# Altium project CMTestBoard.PrjPcb (part 2 of 2)

## Sheet 2_STM32F4.SchDoc
size Letter
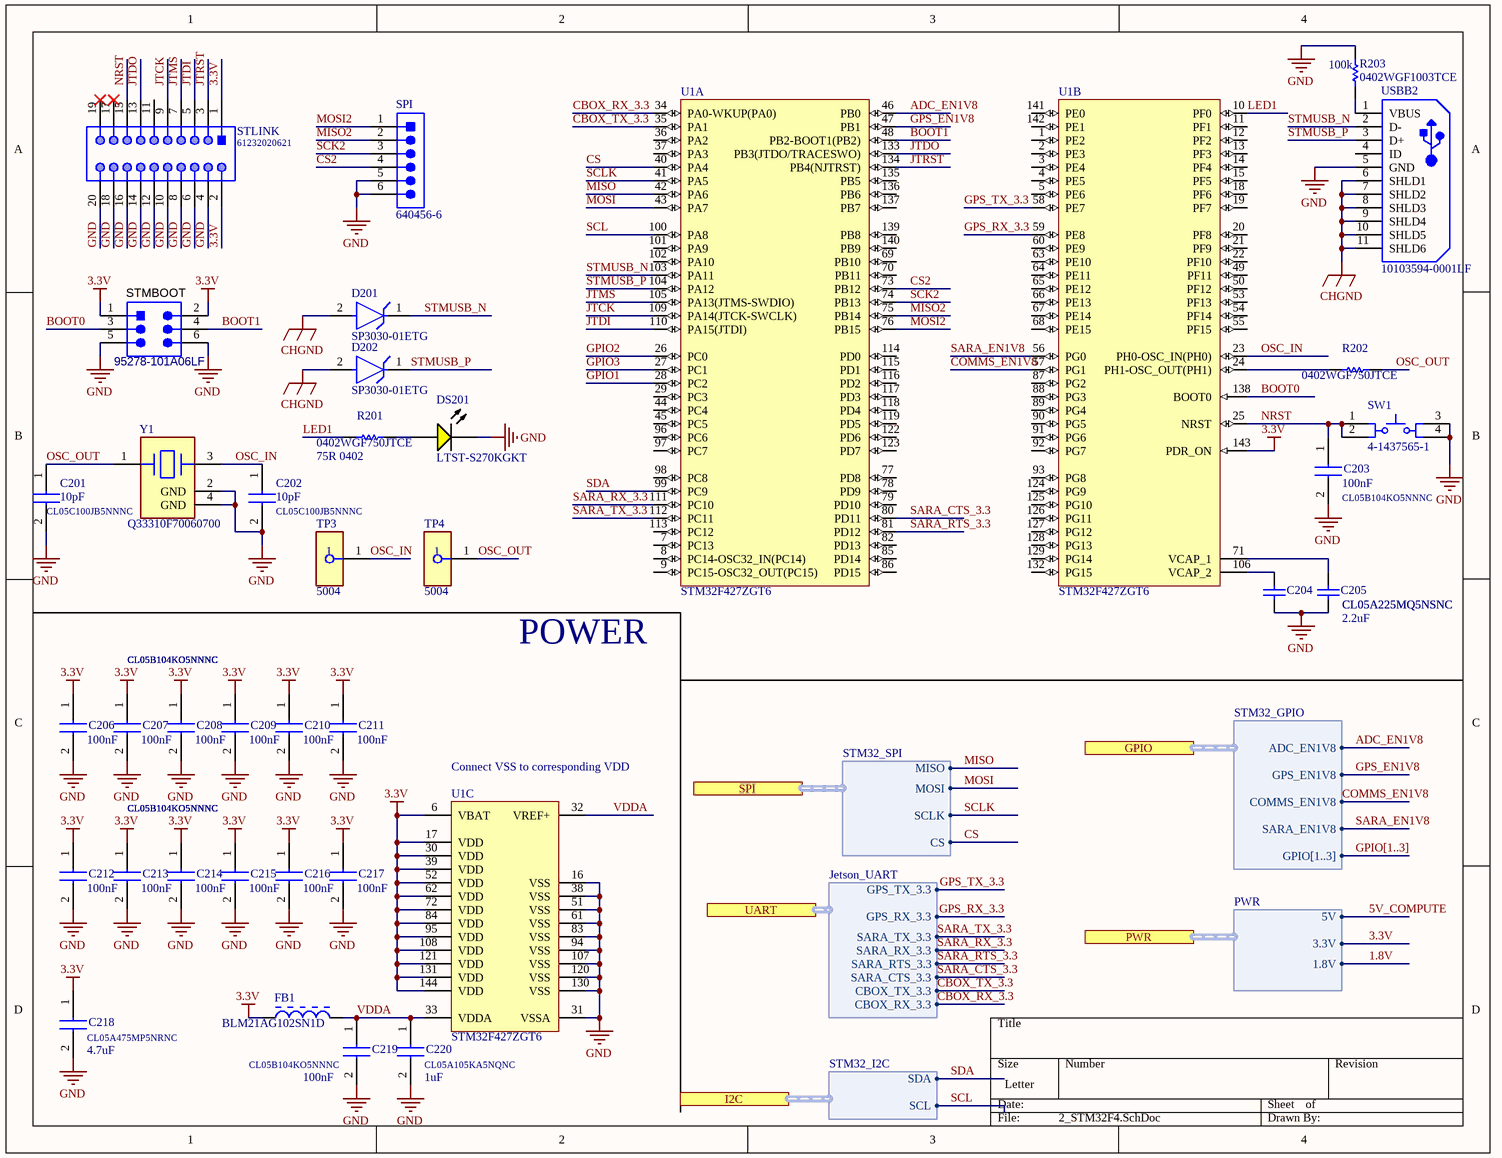
[diagram p5: 2_STM32F4.SchDoc]

### Parts
(Parts that share a designator on the sheet are numbered #1, #2 ... from top to bottom, then left to right.)
C201  CL05C100JB5NNNC  value 10pF  [CAPC1005X55N]
C202  CL05C100JB5NNNC  value 10pF  [CAPC1005X55N]
C203  CL05B104KO5NNNC  value 100nF  [CAPC1005X55N]
C204  CL05A225MQ5NSNC  [0402]
C205  CL05A225MQ5NSNC  [0402]
C206  CL05B104KO5NNNC  value 100nF  [CAPC1005X55N]
C207  CL05B104KO5NNNC  value 100nF  [CAPC1005X55N]
C208  CL05B104KO5NNNC  value 100nF  [CAPC1005X55N]
C209  CL05B104KO5NNNC  value 100nF  [CAPC1005X55N]
C210  CL05B104KO5NNNC  value 100nF  [CAPC1005X55N]
C211  CL05B104KO5NNNC  value 100nF  [CAPC1005X55N]
C212  CL05B104KO5NNNC  value 100nF  [CAPC1005X55N]
C213  CL05B104KO5NNNC  value 100nF  [CAPC1005X55N]
C214  CL05B104KO5NNNC  value 100nF  [CAPC1005X55N]
C215  CL05B104KO5NNNC  value 100nF  [CAPC1005X55N]
C216  CL05B104KO5NNNC  value 100nF  [CAPC1005X55N]
C217  CL05B104KO5NNNC  value 100nF  [CAPC1005X55N]
C218  CL05A475MP5NRNC  value 4.7uF  [CAPC1005X55N]
C219  CL05B104KO5NNNC  value 100nF  [CAPC1005X55N]
C220  CL05A105KA5NQNC  value 1uF  [CAPC1005X55N]
D201  SP3030-01ETG  [FP-SP3030-MFG]
D202  SP3030-01ETG  [FP-SP3030-MFG]
DS201  LTST-S270KGKT  [AVAG-HSMX-C190_V]
FB1  BLM21AG102SN1D  [MURA-BLM21-H1-CHIP-2_V]
R201  0402WGF750JTCE  [RESC1005X40X25ML05T10]
R202  0402WGF750JTCE  [RESC1005X40X25ML05T10]
R203  0402WGF1003TCE  [0402]
SPI  640456-6  [TECO-640456-6_V]
STLINK  61232020621  [61232020621]
STMBOOT  95278-101A06LF  [AMPM-95278-101A06LF_V]
SW1#1  4-1437565-1  [TECO-4-1437565-1_V]
TP3  5004  [FP-5004-MFG]
TP4  5004  [FP-5004-MFG]
U1#1  STM32F427ZGT6  [STM-LQFP144_V]  (parts A,B,C of 3)
USBB2  10103594-0001LF  [FCI-10103594-0001LF_V]
Y1  Q33310F70060700  [FP-7M-MFG]

### Ports
GPIO (harness STM32_GPIO), I2C (harness STM32_I2C), PWR (harness PWR), SPI (harness STM32_SPI), UART (harness Jetson_UART)

### Harnesses
STM32_I2C: SDA, SCL
STM32_SPI: MISO, MOSI, SCLK, CS
STM32_GPIO: ADC_EN1V8, GPS_EN1V8, COMMS_EN1V8, SARA_EN1V8, GPIO[1..3]
PWR: 5V, 3.3V, 1.8V
Jetson_UART: GPS_TX_3.3, GPS_RX_3.3, SARA_TX_3.3, SARA_RX_3.3, CBOX_TX_3.3, CBOX_RX_3.3, SARA_RTS_3.3, SARA_CTS_3.3

### Nets
3.3V: C206.1 C207.1 C208.1 C209.1 C210.1 C211.1 C212.1 C213.1 C214.1 C215.1 C216.1 C217.1 C218.1 FB1.1 STLINK.1 STLINK.2 STMBOOT.1 STMBOOT.2 U1#1.6(VBAT) U1#1.17(VDD) U1#1.30(VDD) U1#1.39(VDD) U1#1.52(VDD) U1#1.62(VDD) U1#1.72(VDD) U1#1.84(VDD) U1#1.95(VDD) U1#1.108(VDD) U1#1.121(VDD) U1#1.131(VDD) U1#1.143(PDR_ON) U1#1.144(VDD) ; port PWR.3.3V
CHGND: D201.2(A) D202.2(A) USBB2.6(SHLD1) USBB2.7(SHLD2) USBB2.8(SHLD3) USBB2.9(SHLD4) USBB2.10(SHLD5) USBB2.11(SHLD6)
GND: C201.2 C202.2 C203.2 C204.1 C205.1 C206.2 C207.2 C208.2 C209.2 C210.2 C211.2 C212.2 C213.2 C214.2 C215.2 C216.2 C217.2 C218.2 C219.2 C220.2 DS201.2(K) R203.2 SPI.5 SPI.6 STLINK.4 STLINK.6 STLINK.8 STLINK.10 STLINK.12 STLINK.14 STLINK.16 STLINK.18 STLINK.20 STMBOOT.5 STMBOOT.6 SW1#1.3 SW1#1.4 U1#1.16(VSS) U1#1.31(VSSA) U1#1.38(VSS) U1#1.51(VSS) U1#1.61(VSS) U1#1.83(VSS) U1#1.94(VSS) U1#1.107(VSS) U1#1.120(VSS) U1#1.130(VSS) USBB2.5(GND) Y1.2(GND) Y1.4(GND)
ADC_EN1V8: U1#1.46(PB0) ; port GPIO.ADC_EN1V8
BOOT0: STMBOOT.3 U1#1.138(BOOT0)
BOOT1: STMBOOT.4 U1#1.48(PB2-BOOT1(PB2))
CBOX_RX_3.3: U1#1.34(PA0-WKUP(PA0)) ; port UART.CBOX_RX_3.3
CBOX_TX_3.3: U1#1.35(PA1) ; port UART.CBOX_TX_3.3
COMMS_EN1V8: U1#1.57(PG1) ; port GPIO.COMMS_EN1V8
CS: U1#1.40(PA4) ; port SPI.CS
CS2: SPI.4 U1#1.73(PB12)
GPIO1: U1#1.28(PC2)
GPIO2: U1#1.26(PC0)
GPIO3: U1#1.27(PC1)
GPS_EN1V8: U1#1.47(PB1) ; port GPIO.GPS_EN1V8
GPS_RX_3.3: U1#1.59(PE8) ; port UART.GPS_RX_3.3
GPS_TX_3.3: U1#1.58(PE7) ; port UART.GPS_TX_3.3
JTCK: STLINK.9 U1#1.109(PA14(JTCK-SWCLK))
JTDI: STLINK.5 U1#1.110(PA15(JTDI))
JTDO: STLINK.13 U1#1.133(PB3(JTDO/TRACESWO))
JTMS: STLINK.7 U1#1.105(PA13(JTMS-SWDIO))
JTRST: STLINK.3 U1#1.134(PB4(NJTRST))
LED1: R201.2 U1#1.10(PF0)
MISO: U1#1.42(PA6) ; port SPI.MISO
MISO2: SPI.2 U1#1.75(PB14)
MOSI: U1#1.43(PA7) ; port SPI.MOSI
MOSI2: SPI.1 U1#1.76(PB15)
NRST: C203.1 STLINK.15 SW1#1.1 SW1#1.2 U1#1.25(NRST)
OSC_IN: C202.1 TP3.1 U1#1.23(PH0-OSC_IN(PH0)) Y1.3
OSC_OUT: C201.1 R202.1 TP4.1 Y1.1
SARA_CTS_3.3: U1#1.80(PD11) ; port UART.SARA_CTS_3.3
SARA_EN1V8: U1#1.56(PG0) ; port GPIO.SARA_EN1V8
SARA_RTS_3.3: U1#1.81(PD12) ; port UART.SARA_RTS_3.3
SARA_RX_3.3: U1#1.111(PC10) ; port UART.SARA_RX_3.3
SARA_TX_3.3: U1#1.112(PC11) ; port UART.SARA_TX_3.3
SCK2: SPI.3 U1#1.74(PB13)
SCL: U1#1.100(PA8) ; port I2C.SCL
SCLK: U1#1.41(PA5) ; port SPI.SCLK
SDA: U1#1.99(PC9) ; port I2C.SDA
STMUSB_N: D201.1(C) U1#1.103(PA11) USBB2.2(D-)
STMUSB_P: D202.1(C) U1#1.104(PA12) USBB2.3(D+)
VDDA: C219.1 C220.1 FB1.2 U1#1.32(VREF+) U1#1.33(VDDA)
NetC204_2: C204.2 U1#1.106(VCAP_2)
NetC205_2: C205.2 U1#1.71(VCAP_1)
NetDS201_1: DS201.1(A) R201.1
NetR202_2: R202.2 U1#1.24(PH1-OSC_OUT(PH1))
NetR203_1: R203.1 USBB2.1(VBUS)

Not connected (* = marked no-connect by the designer): STLINK 11 17* 19*; U1#1 1(PE2) 2(PE3) 3(PE4) 4(PE5) 5(PE6) 7(PC13) 8(PC14-OSC32_IN(PC14)) 9(PC15-OSC32_OUT(PC15)) 11(PF1) 12(PF2) 13(PF3) 14(PF4) 15(PF5) 18(PF6) 19(PF7) 20(PF8) 21(PF9) 22(PF10) 29(PC3) 36(PA2) 37(PA3) 44(PC4) 45(PC5) 49(PF11) 50(PF12) 53(PF13) 54(PF14) 55(PF15) 60(PE9) 63(PE10) 64(PE11) 65(PE12) 66(PE13) 67(PE14) 68(PE15) 69(PB10) 70(PB11) 77(PD8) 78(PD9) 79(PD10) 82(PD13) 85(PD14) 86(PD15) 87(PG2) 88(PG3) 89(PG4) 90(PG5) 91(PG6) 92(PG7) 93(PG8) 96(PC6) 97(PC7) 98(PC8) 101(PA9) 102(PA10) 113(PC12) 114(PD0) 115(PD1) 116(PD2) 117(PD3) 118(PD4) 119(PD5) 122(PD6) 123(PD7) 124(PG9) 125(PG10) 126(PG11) 127(PG12) 128(PG13) 129(PG14) 132(PG15) 135(PB5) 136(PB6) 137(PB7) 139(PB8) 140(PB9) 141(PE0) 142(PE1); USBB2 4(ID)

### Buses and harness runs
bus GPIO[1..3]

### Notes on the sheet
- (near R203) 100k
- (near R201) 75R 0402
- (near C205) 2.2uF
- POWER
- (near U1#1) Connect VSS to corresponding VDD

### Library data of the parts
C201 C202 = C0402C560K5RACTU: 10pF 0402; Manufacturer_Name: Kemet; Datasheet Link: https://content.kemet.com/datasheets/KEM_C1002_X7R_SMD.pdf; Height: 0.55mm; Manufacturer_Part_Number: C0402C560K5RACTU; Arrow Part Number: C0402C560K5RACTU; Mouser Part Number: 80-C0402C560K5RACTU; Mouser Price/Stock: https://www.mouser.co.uk/ProductDetail/KEMET/C0402C560K5RACTU?qs=gt1LBUVyoHmQZW5v3ySgNQ%3D%3D
C203 C206-C220 = C0402C560K5RACTU: 100nF 0402; Manufacturer_Name: Kemet; Datasheet Link: https://content.kemet.com/datasheets/KEM_C1002_X7R_SMD.pdf; Height: 0.55mm; Manufacturer_Part_Number: C0402C560K5RACTU; Arrow Part Number: C0402C560K5RACTU; Mouser Part Number: 80-C0402C560K5RACTU; Mouser Price/Stock: https://www.mouser.co.uk/ProductDetail/KEMET/C0402C560K5RACTU?qs=gt1LBUVyoHmQZW5v3ySgNQ%3D%3D
C204 C205 = Cap: 2.2uF 0402; Published: 8-Jun-2000; LatestRevisionDate: 17-Jul-2002; LatestRevisionNote: Re-released for DXP Platform.; PackageReference: RAD-0.3; Publisher: Altium Limited; PackageDescription: Radial Cap, Thru-Hole; 2 Leads; 0.3 in Pin Spacing
D201 D202 = CMP-08607-000070-1: TVS DIODE 5V 10V SOD882; Manufacturer: Littelfuse; Max Junction Temp: +150°C; Automotive Grade: Grade 1; Direction: Unidirectional; Peak Pulse Current: 3A; Capacitance: 0.5pF; Value: 0.5pF; Number Of Channels: 1; Manufacturer Part Number: SP3030-01ETG; Temperature Range Low: -40°C; Lead Free: Yes; Package: SP3030; Device Class L2: TVS Diodes; Height: 0.6mm; ComponentLink2URL: https://www.littelfuse.com/~/media/electronics/datasheets/tvs_diode_arrays/littelfuse_tvs_diode_array_sp3030_datasheet.pdf.pdf; Device Class L3: unset; Category: Diode; Reverse Standoff Voltage: 5V; RoHS: TRUE; Digikey Description: TVS DIODE 5V 10V SOD882; Octopart: https://octopart.com/sp3030-01etg-littelfuse-29687287; ComponentLink2Description: Datasheet; Device Class L1: Circuit Protection; Automotive: Yes; Temperature: -40°C to +125°C; Temperature Range High: +125°C; Clamping Voltage: 10V; Mouser Description: TVS Diodes / ESD Suppressors 5V 1uA 22kV UNIDIRECTIONAL
DS201 = CMP-1744-00003-1: LED Uni-Color Yellow, 65 mW, 20 mA, -40 to 85 degC, 2-Pin SMD, RoHS, Tape and Reel; Tolerance: 1%; Voltage Rating: 50 V; Power Rating: 100 mW; Case\Package: 0603; Resistance: 390 Ohm; Min Operating Temperature: -55 degC; Length: 1.6 mm; ComponentLink3Description: Package Specification; Mount: Surface Mount; PackageReference: HSMX-C190; ComponentLink2Description: Datasheet; DatasheetVersion: Mar-12; Case Code (Metric): 1608; Pins: 2; Package Quantity: 5000; ComponentLink2URL: http://docs.avagotech.com/docs/AV02-0551EN; ComponentLink1Description: Manufacturer URL; RoHSCompliant: true; Packaging: Tape and Reel; PackageDescription: 2-Pin Surface Mount Device, Body 1.6 x 0.8 mm, Height 0.9 mm; REACH SVHC: No SVHC; ComponentLink3URL: http://www.fairchildsemi.com/dwg/MA/MA03D.pdf; Voltage Rating (DC): 50 V; Width: 0.8 mm; ComponentLink1URL: http://www.avagotech.com/; Max Operating Temperature: 155 degC; Case Code (Imperial): 0603; Height: 0.45 mm
FB1 = CMP-0686-00665-2: Chip Ferrite Bead for General Signal lines, 1000 Ohm, 500 mA, -55 to 125 degC, 2 x 1.25 x 1.05 mm SMD, Tape and Reel; Manufacturer: Murata; Impedance (at 100 MHz): 1000 Ohm +/- 25%; DC Resistance: 0.28 Ohm Max.; Rated Current: 500 mA; ComponentLink1Description: Manufacturer URL; PackageDescription: 2-Pin Chip, Body 2 x 1.25 mm; DatasheetVersion: 08/2013; PartNumber: BLM21AG102SN1D; Mounting Technology: Surface Mount; Operating Temperature Range: -55 to 125 degC; ComponentLink2URL: http://www.murata.com/products/catalog/pdf/c31e.pdf; ComponentLink3Description: Package Specification; ComponentLink2Description: Datasheet; Packing: Tape and Reel; ComponentLink3URL: http://www.murata.com/products/catalog/pdf/c31e.pdf; ComponentLink1URL: http://www.murata.com/; PackageReference: BLM21_H1050-2
R201 = CMP-2002-07344-1: 75R 0402; Part Number: RC0402FR-07100RL; Manufacturer: Yageo / Phycomp
R202 = CMP-2002-07344-1: 22R 0402; Part Number: RC0402FR-07100RL; Manufacturer: Yageo / Phycomp
R203 = Res1: 100k 0402; Published: 8-Jun-2000; LatestRevisionDate: 17-Jul-2002; LatestRevisionNote: Re-released for DXP Platform.; PackageReference: AXIAL-0.3; Publisher: Altium Limited; PackageDescription: Axial Device, Thru-Hole; 2 Leads; 0.3 in Pin Spacing
SPI = CMP-2000-05661-1: Male Header, Pitch 2.54 mm, 1 x 6 Position, Height 10.03 mm, Tail Length 3.56 mm, -55 to 105 degC, Bulk; Manufacturer: TE Connectivity; Contact Centerline Spacing: 0.100 / in.; Number of Contacts: 6; Current, Rating: 5 / A; Agency Approvals: CSA,UL; Material, Contact: CopperAlloy; Mounting Hole Size: 0.04 / "; Brand/Series: MTA-100Series; Pin Spacing: 0.1 / "; Mount Angle: Vertical; Contact Termination Area Plating: Tin; Angle: Straight; Primary Type: InterconnectSystem; Standards: RoHSCompliant,ELVCompliant,UL94V-0; Temperature, Operating: -55to+105 / °C; Material, Housing: Polyester; Special Features: Pinstrip; Color, Housing: White; Connector Type: MTA-100; Voltage, Rating: 250 / V; Termination: Solder; Package Reference: 640456-6; Size, Post: 0.025 / in.; Color: White; Datasheet URL: https://datasheet.ciiva.com/25618/0900766b80eb7fdd-25618163.pdf; Manufacturer URL: http://www.te.com/; Mounting Type: PCMount; Length, Pin: 0.14 / "; Type: PCBPlug; Length, Overall: 0.6 / "; Mounting Technology: ThroughHole; Number of Rows: 1; Contact Shape: Square; Contact Mating Area Plating: Tin; Datasheet Version: Rev. W, 05/2005; Number of Positions: 6; Package Description: Male Header, Pitch 2.54 mm, 1 x 6 Position, Height 10.03 mm, Tail Length 3.56 mm; Contact Plating: Tin; Length, Terminal Post: 0.14 / in.; Flammability Rating: UL94V-0
STLINK = CMP-1502-00063-1: Male Box Header WR-BHD, SMT, Vertical, pitch 2.54 mm, 20 pins; Manufacturer: Wurth Elektronik; Withstanding Voltage: 500VAC; Working Voltage: 250VAC; Pin Number: 20; Contact Resistance: 20mOhm; Pitch: 2.54mm; Datasheet URL: https://katalog.we-online.de/em/datasheet/6123xx20621.pdf; Gender: Male; Packaging: TapeandReel; Operating Temperature: -40to125degC; Mounting Technology: SMT; Orientation: Vertical; Published Date: August2018; Part Number: 61232020621; Manufacturer URL: http://www.we-online.de; Package Reference: 61232020621; Publisher: WurthElektronik
STMBOOT = CMP-1743-00002-1: Male Header, Pitch 2.54 mm, 2 x 3 Position, Height 14.4 mm, RoHS, Tape and Reel; Power Rating: 100 mW; Tolerance: 1%; Resistance: 49.9 Ohm; Case\Package: 0603; Voltage Rating: 50 V; DatasheetVersion: Rev. AC, 03/2016; PackageDescription: Male Header, Pitch 2.54 mm, 2 x 3 Position, Height 14.4 mm; REACH SVHC: No SVHC; Height: 0.45 mm; Mount: Surface Mount; Case Code (Imperial): 0603; Max Operating Temperature: 155 degC; Case Code (Metric): 1608; Packaging: Tape and Reel; RoHSCompliant: true; ComponentLink1Description: Datasheet; Min Operating Temperature: -55 degC; Length: 1.6 mm; Width: 0.8 mm; ComponentLink1URL: http://portal.fciconnect.com/Comergent//fci/drawing/95278.pdf; PackageReference: 95278-101A06LF
SW1#1 = CMP-2000-05602-1: Tactile Switch, 50 mA, 12 VDC, -20 to 85 degC, 4-Pin SMD, RoHS, Bulk; Manufacturer: TEConnectivity/AMPBrand; Illumination Type: N/R; Maximum Contact Resistance: 100mOhm; Actuator Style: RoundButton; Actuator Length: 1.4mm; Contact Rating @ Voltage: 0.05@12VDCA; Maximum DC Voltage Rating: 12V; Body Orientation: Straight; Ground Terminal: No; Dielectric Strength: 500VAC; Operating Force: 1.57N; Electrical Life: 100000Cycle; Mechanical Life: N/A; Family: FSMJSMA; Contact Material: CopperAlloy; Type: N/A; RoHS: Yes; Pole Throw Configuration: N/A; Operating Temperature: -20to85C; Minimum Insulation Resistance: 100MOhm; Package Description: 4-Pin Surface Mount Device, Body 6 x 6 mm, Pitch 9.1 mm; Housing Material: N/A; Switch Configuration: N/A; Mounting: SurfaceMount,GullWing; Datasheet URL: https://datasheet.ciiva.com/14635/0900766b80912216-14635826.pdf; Packaging: Bulk; Base Material: N/A; Actuator Color: N/A; Dimension: 6x10x5.25mm; Contact Plating: Silver; Seal Location: N/A; Mounting Technology: SurfaceMount; Part No: 4-1437565-1; Seal Description: N/A; Maximum AC Voltage Rating: N/A; Datasheet Version: 04/2007; Manufacturer URL: http://www.te.com/; Package Reference: 4-1437565-1; Product Weight: N/A
TP3 TP4 = CMP-2000-05575-2: PC TEST POINT MINIATURE YELLOW; Manufacturer: Keystone; Number Of Contacts: 1; Is Female: yes; Device Class L1: Connectors; Manufacturer Part Number: 5004; Digikey Description: PC TEST POINT MINIATURE YELLOW; ComponentLink2URL: https://www.keyelco.com/product-pdf.cfm?p=1313; Lead Free: Yes; ComponentLink2Description: Datasheet; Category: Conn; Height: 4.72mm; Octopart: https://octopart.com/5004-keystone-28591; Mouser Description: TEST POINT PC MINI .040"D YELLOW; Device Class L3: unset; Contact Material: Silver; Package: 5004; Automotive: No; Device Class L2: unset; RoHS: TRUE
U1#1 = CMP-0243-00054-2: ARM Cortex-M4 32-bit MCU+FPU, 210 DMIPS, 1024 kB Flash, 256 kB Internal RAM, 114 I/Os, 144-pin LQFP, -40 to 85 degC, Tray; Manufacturer: STMicroelectronics; I/Os (High Current): 114; Supply Voltage(Vcc) max (V): 3.6; FLASH Size (Prog) (kB): 1024; Supply Voltage(Vcc) min (V): 1.8; Internal RAM Size (kB): 256; D/A Converter: 2x12-bit; Operating Frequency(F) (Processor speed) (MHz): 168; Packing: Tray; ComponentLink2URL: http://www.st.com/st-web-ui/static/active/en/resource/technical/document/datasheet/DM00071990.pdf; ComponentLink2Description: Datasheet; ComponentLink3URL: http://www.st.com/st-web-ui/static/active/en/resource/technical/document/datasheet/DM00037051.pdf; ComponentLink1Description: Manufacturer URL; PackageReference: LQFP144; Core: ARM Cortex-M4; ComponentLink1URL: http://www.st.com/web/en/home.html; PackageDescription: 144-Pin Low Profile Quad Flat Package, 20 x 20 mm Body, 0.5 mm Pitch; Mounting Technology: Surface Mount; ComponentLink3Description: Package Specification; PackageVersion: Rev. 4, 06/2013; DatasheetVersion: Rev. 1; PartNumber: STM32F427ZGT6
USBB2 = CMP-1698-00007-1: Micro USB 2.0 B Receptacle, -55 to 85 degC, 5-Pin SMD, RoHS, Tape and Reel; Type (Resistor): Thick Film; Case\Package: 0603; Resistance: 4.7 kohm; Tolerance: 1%; Voltage Rating: 75 V; Power Rating: 100 mW; Case Code (Imperial): 0603; Case Code (Metric): 1608; REACH SVHC: Unknown; ComponentLink1URL: http://portal.fciconnect.com/; Package Quantity: 5000; RoHSCompliant: true; Max Operating Temperature: 155 degC; Min Operating Temperature: -55 degC; Mount: Surface Mount; Weight: 7.1E-05 oz; Length: 1.55 mm; PackageDescription: 5-Pin Surface Mount Device, Body 8.04 x 5.62 mm; Pins: 2; Height: 0.45 mm; ComponentLink2Description: Datasheet; ComponentLink2URL: http://portal.fciconnect.com/Comergent//fci/drawing/10103594.pdf; PackageReference: FCI-10103594-0001LF; DatasheetVersion: Rev. A, 06/2010; Width: 0.85 mm; Packaging: Tape and Reel; ComponentLink1Description: Manufacturer URL; LCSC Part #: *
Y1 = CMP-18717-000014-1: CRYSTAL 12.0000MHZ 15PF SMD; Load Capacitance: 12pF; Frequency Tolerance: 30ppm; Frequency: 32MHz; ESR (Equivalent Series Resistance): 60R; Max Operating Temperature: 85°C; Case/Package: SMD/SMT; Min Operating Temperature: -40°C; Mount: Surface Mount; Packaging: Tape and Reel; Frequency Stability: 30ppm; Width: 0.098inch; Length: 0.126inch; Package Quantity: 1; Lead Free: Lead Free; Height: 0.031inch

## Sheet XC95144XL.SchDoc
size Letter
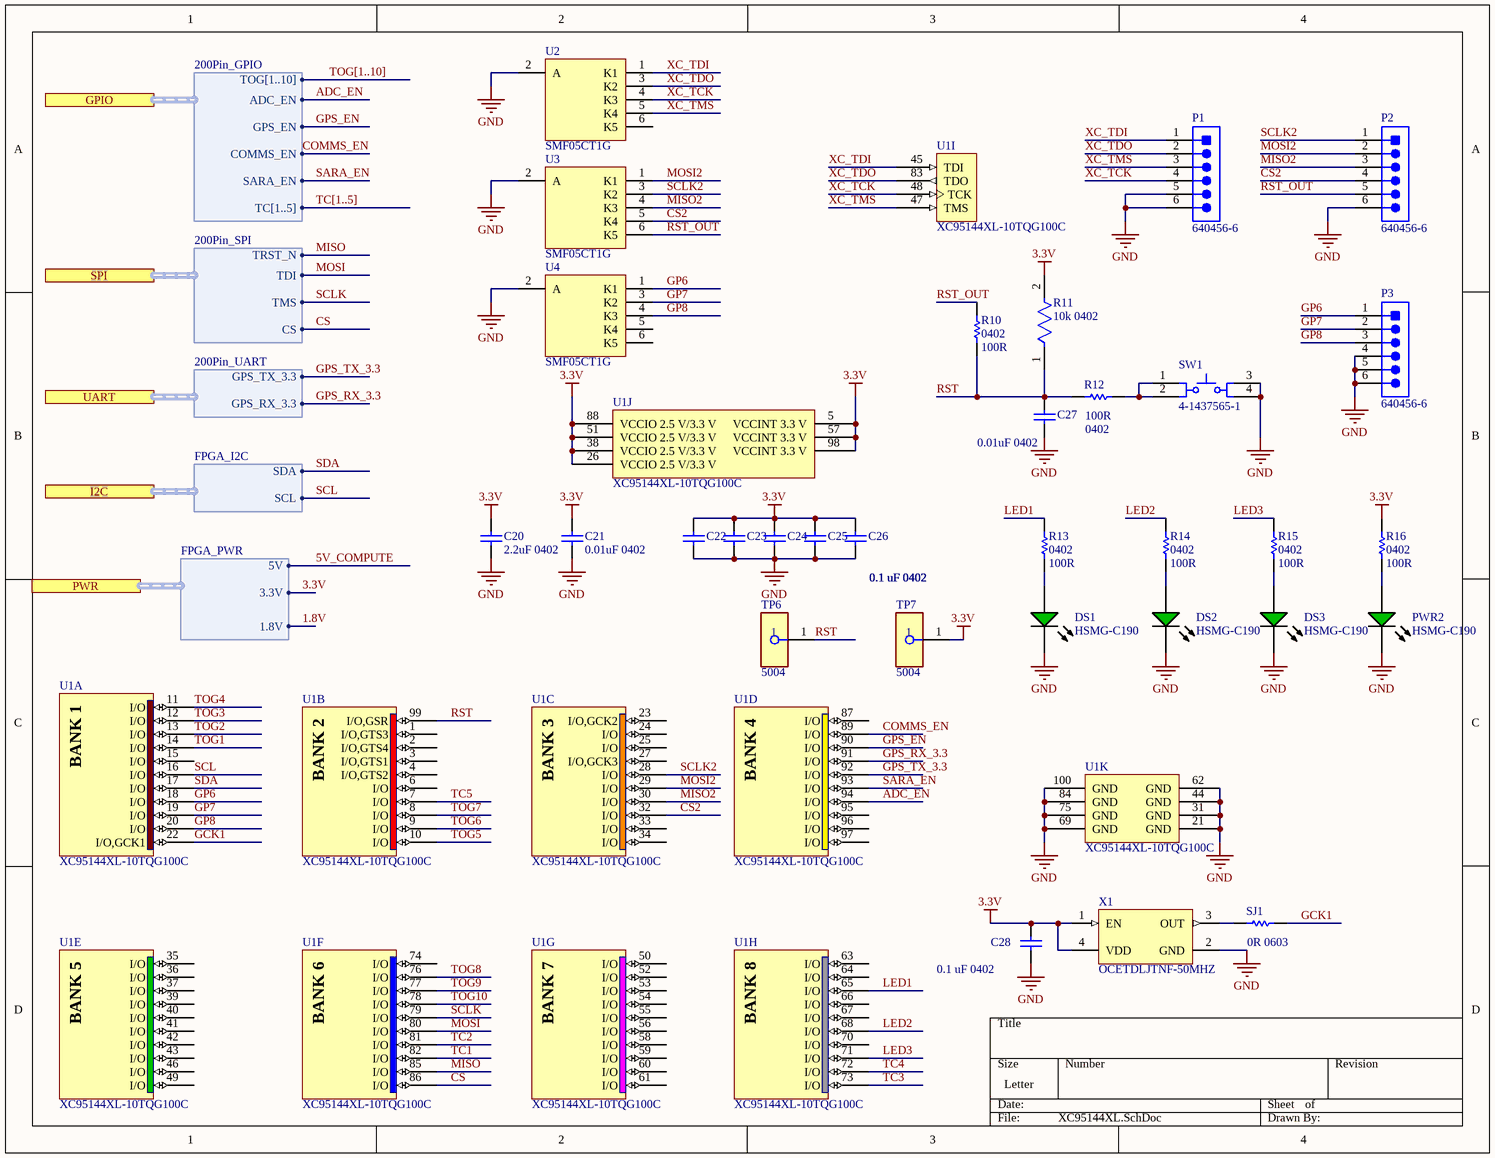
[diagram p6: XC95144XL.SchDoc]

### Parts
(Parts that share a designator on the sheet are numbered #1, #2 ... from top to bottom, then left to right.)
C20#1  2.2uF 0402  [CAPC0402(1005)60_M]
C21#1  0.01uF 0402  [CAPC1005X55X30NL05T10]
C22#1  0.1 uF 0402  [CAPC1005X55X30ML05T10]
C23#1  0.1 uF 0402  [CAPC1005X55X30ML05T10]
C24#1  0.1 uF 0402  [CAPC1005X55X30ML05T10]
C25#1  0.1 uF 0402  [CAPC1005X55X30ML05T10]
C26#1  0.1 uF 0402  [CAPC1005X55X30ML05T10]
C27#1  0.01uF 0402  [CAPC1005X55X30NL05T10]
C28#1  0.1 uF 0402  [CAPC1005X55X30ML05T10]
DS1#1  HSMG-C190  [AVAG-HSMX-C190_V]
DS2#1  HSMG-C190  [AVAG-HSMX-C190_V]
DS3#1  HSMG-C190  [AVAG-HSMX-C190_V]
P1#2  640456-6  [TECO-640456-6_V]
P2#1  640456-6  [TECO-640456-6_V]
P3#1  640456-6  [TECO-640456-6_V]
PWR2#1  HSMG-C190  [AVAG-HSMX-C190_V]
R10#2  0402  spec: 100R  [RESC1005X40X25ML05T10]
R11  10k 0402  [FP-CRCW0402-e3-IPC_B]
R12  0402  spec: 100R  [RESC1005X40X25ML05T10]
R13#1  0402  spec: 100R  [RESC1005X40X25ML05T10]
R14#1  0402  spec: 100R  [RESC1005X40X25ML05T10]
R15#1  0402  spec: 100R  [RESC1005X40X25ML05T10]
R16#1  0402  spec: 100R  [RESC1005X40X25ML05T10]
SJ1#1  0R 0603  [RESC1609X55X30ML10T20]
SW1#2  4-1437565-1  [TECO-4-1437565-1_V]
TP6#2  5004  [FP-5004-MFG]
TP7#2  5004  [FP-5004-MFG]
U1#2  XC95144XL-10TQG100C  [TQG100_L]  (parts A,B,C,D,E,F,G,H,I,J,K of 11)
U2#2  SMF05CT1G  [ONSC-SC70-6-419B-02_W_V]
U3#2  SMF05CT1G  [ONSC-SC70-6-419B-02_W_V]
U4#2  SMF05CT1G  [ONSC-SC70-6-419B-02_W_V]
X1#1  OCETDLJTNF-50MHZ  [TXC-L500W700H130-4_V]

### Ports
GPIO (harness 200Pin_GPIO), I2C (harness FPGA_I2C), PWR (harness FPGA_PWR), SPI (harness 200Pin_SPI), UART (harness 200Pin_UART)

### Harnesses
FPGA_PWR: 5V, 3.3V, 1.8V
FPGA_I2C: SDA, SCL
200Pin_UART: GPS_TX_3.3, GPS_RX_3.3
200Pin_SPI: TRST_N, TDI, TMS, CS
200Pin_GPIO: TOG[1..10], ADC_EN, GPS_EN, COMMS_EN, SARA_EN, TC[1..5]

### Nets
3.3V: C20#1.2 C21#1.2 C22#1.2 C23#1.2 C24#1.2 C25#1.2 C26#1.2 C28#1.2 R11.2 R16#1.2 TP7#2.1 U1#2.5(VCCINT_3.3_V) U1#2.26(VCCIO_2.5_V/3.3_V) U1#2.38(VCCIO_2.5_V/3.3_V) U1#2.51(VCCIO_2.5_V/3.3_V) U1#2.57(VCCINT_3.3_V) U1#2.88(VCCIO_2.5_V/3.3_V) U1#2.98(VCCINT_3.3_V) X1#1.1(EN) X1#1.4(VDD) ; port PWR.3.3V
GND: C20#1.1 C21#1.1 C22#1.1 C23#1.1 C24#1.1 C25#1.1 C26#1.1 C27#1.1 C28#1.1 DS1#1.2(K) DS2#1.2(K) DS3#1.2(K) P1#2.5 P1#2.6 P2#1.6 P3#1.4 P3#1.5 P3#1.6 PWR2#1.2(K) SW1#2.3 SW1#2.4 U1#2.21(GND) U1#2.31(GND) U1#2.44(GND) U1#2.62(GND) U1#2.69(GND) U1#2.75(GND) U1#2.84(GND) U1#2.100(GND) U2#2.2(A) U3#2.2(A) U4#2.2(A) X1#1.2(GND)
1.8V: port PWR.1.8V
5V_COMPUTE: port PWR.5V
ADC_EN: U1#2.94(I/O) ; port GPIO.ADC_EN
COMMS_EN: U1#2.89(I/O) ; port GPIO.COMMS_EN
CS: U1#2.86(I/O) ; port SPI.CS
CS2: P2#1.4 U1#2.32(I/O) U3#2.5(K4)
GCK1: SJ1#1.2 U1#2.22(I/O,GCK1)
GP6: P3#1.1 U1#2.18(I/O) U4#2.1(K1)
GP7: P3#1.2 U1#2.19(I/O) U4#2.3(K2)
GP8: P3#1.3 U1#2.20(I/O) U4#2.4(K3)
GPS_EN: U1#2.90(I/O) ; port GPIO.GPS_EN
GPS_RX_3.3: U1#2.91(I/O) ; port UART.GPS_RX_3.3
GPS_TX_3.3: U1#2.92(I/O) ; port UART.GPS_TX_3.3
LED1: R13#1.2 U1#2.65(I/O)
LED2: R14#1.2 U1#2.68(I/O)
LED3: R15#1.2 U1#2.71(I/O)
MISO: U1#2.85(I/O) ; port SPI.TRST_N
MISO2: P2#1.3 U1#2.30(I/O) U3#2.4(K3)
MOSI: U1#2.80(I/O) ; port SPI.TDI
MOSI2: P2#1.2 U1#2.29(I/O) U3#2.1(K1)
RST: C27#1.2 R10#2.2 R11.1 R12.2 TP6#2.1 U1#2.99(I/O,GSR)
RST_OUT: P2#1.5 R10#2.1 U3#2.6(K5)
SARA_EN: U1#2.93(I/O) ; port GPIO.SARA_EN
SCL: U1#2.16(I/O) ; port I2C.SCL
SCLK: U1#2.79(I/O) ; port SPI.TMS
SCLK2: P2#1.1 U1#2.28(I/O) U3#2.3(K2)
SDA: U1#2.17(I/O) ; port I2C.SDA
TC1: U1#2.82(I/O)
TC2: U1#2.81(I/O)
TC3: U1#2.73(I/O)
TC4: U1#2.72(I/O)
TC5: U1#2.7(I/O)
TOG1: U1#2.14(I/O)
TOG2: U1#2.13(I/O)
TOG3: U1#2.12(I/O)
TOG4: U1#2.11(I/O)
TOG5: U1#2.10(I/O)
TOG6: U1#2.9(I/O)
TOG7: U1#2.8(I/O)
TOG8: U1#2.76(I/O)
TOG9: U1#2.77(I/O)
TOG10: U1#2.78(I/O)
XC_TCK: P1#2.4 U1#2.48(TCK) U2#2.4(K3)
XC_TDI: P1#2.1 U1#2.45(TDI) U2#2.1(K1)
XC_TDO: P1#2.2 U1#2.83(TDO) U2#2.3(K2)
XC_TMS: P1#2.3 U1#2.47(TMS) U2#2.5(K4)
NetDS1#1_1: DS1#1.1(A) R13#1.1
NetDS2#1_1: DS2#1.1(A) R14#1.1
NetDS3#1_1: DS3#1.1(A) R15#1.1
NetPWR2#1_1: PWR2#1.1(A) R16#1.1
NetR12_1: R12.1 SW1#2.1 SW1#2.2
NetSJ1#1_1: SJ1#1.1 X1#1.3(OUT)

Not connected (* = marked no-connect by the designer): U1#2 1(I/O,GTS3) 2(I/O,GTS4) 3(I/O,GTS1) 4(I/O,GTS2) 6(I/O) 15(I/O) 23(I/O,GCK2) 24(I/O) 25(I/O) 27(I/O,GCK3) 33(I/O) 34(I/O) 35(I/O) 36(I/O) 37(I/O) 39(I/O) 40(I/O) 41(I/O) 42(I/O) 43(I/O) 46(I/O) 49(I/O) 50(I/O) 52(I/O) 53(I/O) 54(I/O) 55(I/O) 56(I/O) 58(I/O) 59(I/O) 60(I/O) 61(I/O) 63(I/O) 64(I/O) 66(I/O) 67(I/O) 70(I/O) 74(I/O) 87(I/O) 95(I/O) 96(I/O) 97(I/O); U2#2 6(K5); U4#2 5(K4) 6(K5)

### Buses and harness runs
bus TC[1..5]
bus TOG[1..10]

### Notes on the sheet
- (in symbol CMP-0209-00147-1, part A) BANK 1
- (in symbol CMP-0209-00147-1, part B) BANK 2
- (in symbol CMP-0209-00147-1, part C) BANK 3
- (in symbol CMP-0209-00147-1, part D) BANK 4
- (in symbol CMP-0209-00147-1, part E) BANK 5
- (in symbol CMP-0209-00147-1, part F) BANK 6
- (in symbol CMP-0209-00147-1, part G) BANK 7
- (in symbol CMP-0209-00147-1, part H) BANK 8

### Library data of the parts
C20#1 = CMP-1034-02125-1: CAP 2.2uF 6.3V ±10% 0402 (1005 Metric) Thickness 0.6mm SMD; Case-Metric: 1005; Case-EIA: 0402; Tolerance: Â±10%; Value: 2.2uF; Technology: SMT; Rated Voltage: 6.3 V; Max Thickness: 0.6 mm
C21#1 C27#1 = CMP-2008-03072-1: Manufacturer: Kemet; Part Number: C0402C103K4RACTU
C22#1 C23#1 C24#1 C25#1 C26#1 C28#1 = CMP-2008-03080-1: Manufacturer: Kemet; Part Number: C0402C104J4RACTU
DS1#1 DS2#1 DS3#1 PWR2#1 = CMP-1744-00002-1: Chip LED, Green, 2.2 V, -40 to 85 degC, 2-Pin SMD, RoHS, Tape and Reel; Frequency: 400 KHz; Max Supply Voltage: 5.5 V; Access Time: 3500 ns; Clock Frequency: 100 KHz; Case\Package: SOIC; Density: 32 kb; Nominal Supply Current: 2 mA; Interface: Serial; Min Supply Voltage: 1.7 V; Packaging: Tape and Reel; PackageReference: HSMX-C190; ComponentLink2URL: http://docs.avagotech.com/docs/AV02-0551EN; RoHSCompliant: true; Pins: 8; REACH SVHC: No SVHC; Max Operating Temperature: 85 degC; Width: 4 mm; Radiation Hardening: No; Package Quantity: 3000; ComponentLink3Description: Package Specification; ComponentLink1Description: Manufacturer URL; Min Operating Temperature: -40 degC; PackageDescription: 2-Pin Surface Mount Device, Body 1.6 x 0.8 mm, Height 0.9 mm; Max Clock Frequency: 100 KHz; Height: 1.5 mm; ComponentLink1URL: http://www.avagotech.com/; DatasheetVersion: Mar-12; ComponentLink2Description: Datasheet; Mount: Surface Mount; Length: 5 mm; ComponentLink3URL: http://www.fairchildsemi.com/dwg/MA/MA03D.pdf
P1#2 P2#1 P3#1 = CMP-2000-05661-1: as SPI on sheet 2_STM32F4; Termination: Solder; Package Reference: 640456-6; Size, Post: 0.025 / in.; Color: White; Datasheet URL: https://datasheet.ciiva.com/25618/0900766b80eb7fdd-25618163.pdf; Manufacturer URL: http://www.te.com/; Mounting Type: PCMount; Length, Pin: 0.14 / "; Type: PCBPlug; Length, Overall: 0.6 / "; Mounting Technology: ThroughHole; Number of Rows: 1; Contact Shape: Square; Contact Mating Area Plating: Tin; Datasheet Version: Rev. W, 05/2005; Number of Positions: 6; Package Description: Male Header, Pitch 2.54 mm, 1 x 6 Position, Height 10.03 mm, Tail Length 3.56 mm; Contact Plating: Tin; Length, Terminal Post: 0.14 / in.; Flammability Rating: UL94V-0
R10#2 R12 R13#1 R14#1 R15#1 R16#1 = CMP-2002-07344-1: Part Number: RC0402FR-07100RL; Manufacturer: Yageo / Phycomp
R11 = CMP-02407-001195-1: RES SMD 10K OHM 1% 1/16W 0402; Power Rating: 63mW; Resistance: 10kR; Voltage Rating: 50V; Temperature Coefficient: 100ppm/°C; Case Code (Metric): 1005; Features: Automotive AEC-Q200; Termination: SMD/SMT; Mount: Surface Mount; Package Quantity: 10; Packaging: Tape and Reel; Case Code (Imperial): 0402; Weight: 2.3E-05oz; Lead Free: Lead Free; Width: 0.02inch; Max Power Dissipation: 63mW; Tolerance: 1%; Number of Terminations: 2; Height: 0.35mm; Number of Pins: 2; Composition: Thick Film; Length: 1mm; Voltage Rating (DC): 50V; Case/Package: 0402; Radiation Hardening: No; Contact Plating: Tin; Depth: 0.5mm; Military Standard: Not; Min Operating Temperature: -55°C; Max Operating Temperature: 155°C
SJ1#1 = CMP-2000-03816-1: Part Number: CRCW06030000Z0EA; Manufacturer: Vishay Dale
SW1#2 = CMP-2000-05602-1: as SW1#1 on sheet 2_STM32F4; Mechanical Life: N/A; Family: FSMJSMA; Contact Material: CopperAlloy; Type: N/A; RoHS: Yes; Pole Throw Configuration: N/A; Operating Temperature: -20to85C; Minimum Insulation Resistance: 100MOhm; Package Description: 4-Pin Surface Mount Device, Body 6 x 6 mm, Pitch 9.1 mm; Housing Material: N/A; Switch Configuration: N/A; Mounting: SurfaceMount,GullWing; Datasheet URL: https://datasheet.ciiva.com/14635/0900766b80912216-14635826.pdf; Packaging: Bulk; Base Material: N/A; Actuator Color: N/A; Dimension: 6x10x5.25mm; Contact Plating: Silver; Seal Location: N/A; Mounting Technology: SurfaceMount; Part No: 4-1437565-1; Seal Description: N/A; Maximum AC Voltage Rating: N/A; Datasheet Version: 04/2007; Manufacturer URL: http://www.te.com/; Package Reference: 4-1437565-1; Product Weight: N/A
TP6#2 TP7#2 = CMP-2000-05575-2: as TP3 on sheet 2_STM32F4; Device Class L1: Connectors; Manufacturer Part Number: 5004; Digikey Description: PC TEST POINT MINIATURE YELLOW; ComponentLink2URL: https://www.keyelco.com/product-pdf.cfm?p=1313; Lead Free: Yes; ComponentLink2Description: Datasheet; Category: Conn; Height: 4.72mm; Octopart: https://octopart.com/5004-keystone-28591; Mouser Description: TEST POINT PC MINI .040"D YELLOW; Device Class L3: unset; Contact Material: Silver; Package: 5004; Automotive: No; Device Class L2: unset; RoHS: TRUE
U1#2 = CMP-0209-00147-1: FastFLASH XC900XL, 3.3V High-Performance 144 Macrocell CPLD, 81 User I/Os, 100-Pin TQFP, Speed Grade 10, Commercial Grade, Pb-Free; PackageDescription: 100-Pin Thin Quad Flat Pack (TQG100) - Pb-Free; PackageVersion: ver1.2, Jun-2004; DatasheetVersion: ver2.0, Apr-2007; PackageReference: TQG100
U2#2 U3#2 U4#2 = CMP-1061-00155-1: 5-Line Transient Voltage Suppressor Array, 6-Pin SC70, Pb-Free, Tape and Reel; Manufacturer: On Semiconductor; PPK Max (W): 100; Direction: Unidirectional; IR Max (uA): 5; PackageDescription: 6-Pin Small Outline Transistor, Body 2 x 1.25 mm, Pitch 0.65 mm; PackageReference: SC70-6-419B-02_W; ComponentLink2Description: Datasheet; Mounting Technology: Surface Mount; Packing: Tape and Reel; DatasheetVersion: Rev. 4; ComponentLink1Description: Manufacturer URL; ComponentLink2URL: http://www.onsemi.com/pub_link/Collateral/SMF05C-D.PDF; ComponentLink3Description: Package Specification; ComponentLink1URL: http://www.onsemi.com/; ComponentLink3URL: http://www.onsemi.com/pub_link/Collateral/SMF05C-D.PDF; PackageVersion: Rev. W; PartNumber: SMF05CT1G; RoHS: Pb-Free
X1#1 = CMP-0269-00001-1: OSC, 50.000 MHZ, ± 25 ppm, 3.3 V, SMT / OCETDLJTNF-50MHZ; PartNumber: 7W-50.000MBA-T; Rise/Fall Time: 7 ns; Body Shape: Rectangular, 4 SMD; Frequency Stability: Â± 25 ppm(-10 to +70 degC); ComponentLink2Description: Datasheet; Mounting Technology: Surface Mount; Storage Temperature: -50 to 125 degC; PackageReference: L500W700H130-4; ComponentLink1URL: http://www.txccrystal.com/; ComponentLink2URL: http://www.txccrystal.com/images/pdf/7w-tight.pdf; ComponentLink1Description: Manufacturer URL; PackageDescription: 4-Pin SMT LED, 7 x 5 mm Body; Operating Temperature Range: -40 to 85 degC

## Sheet EPM240T100C5N.SchDoc
size Letter
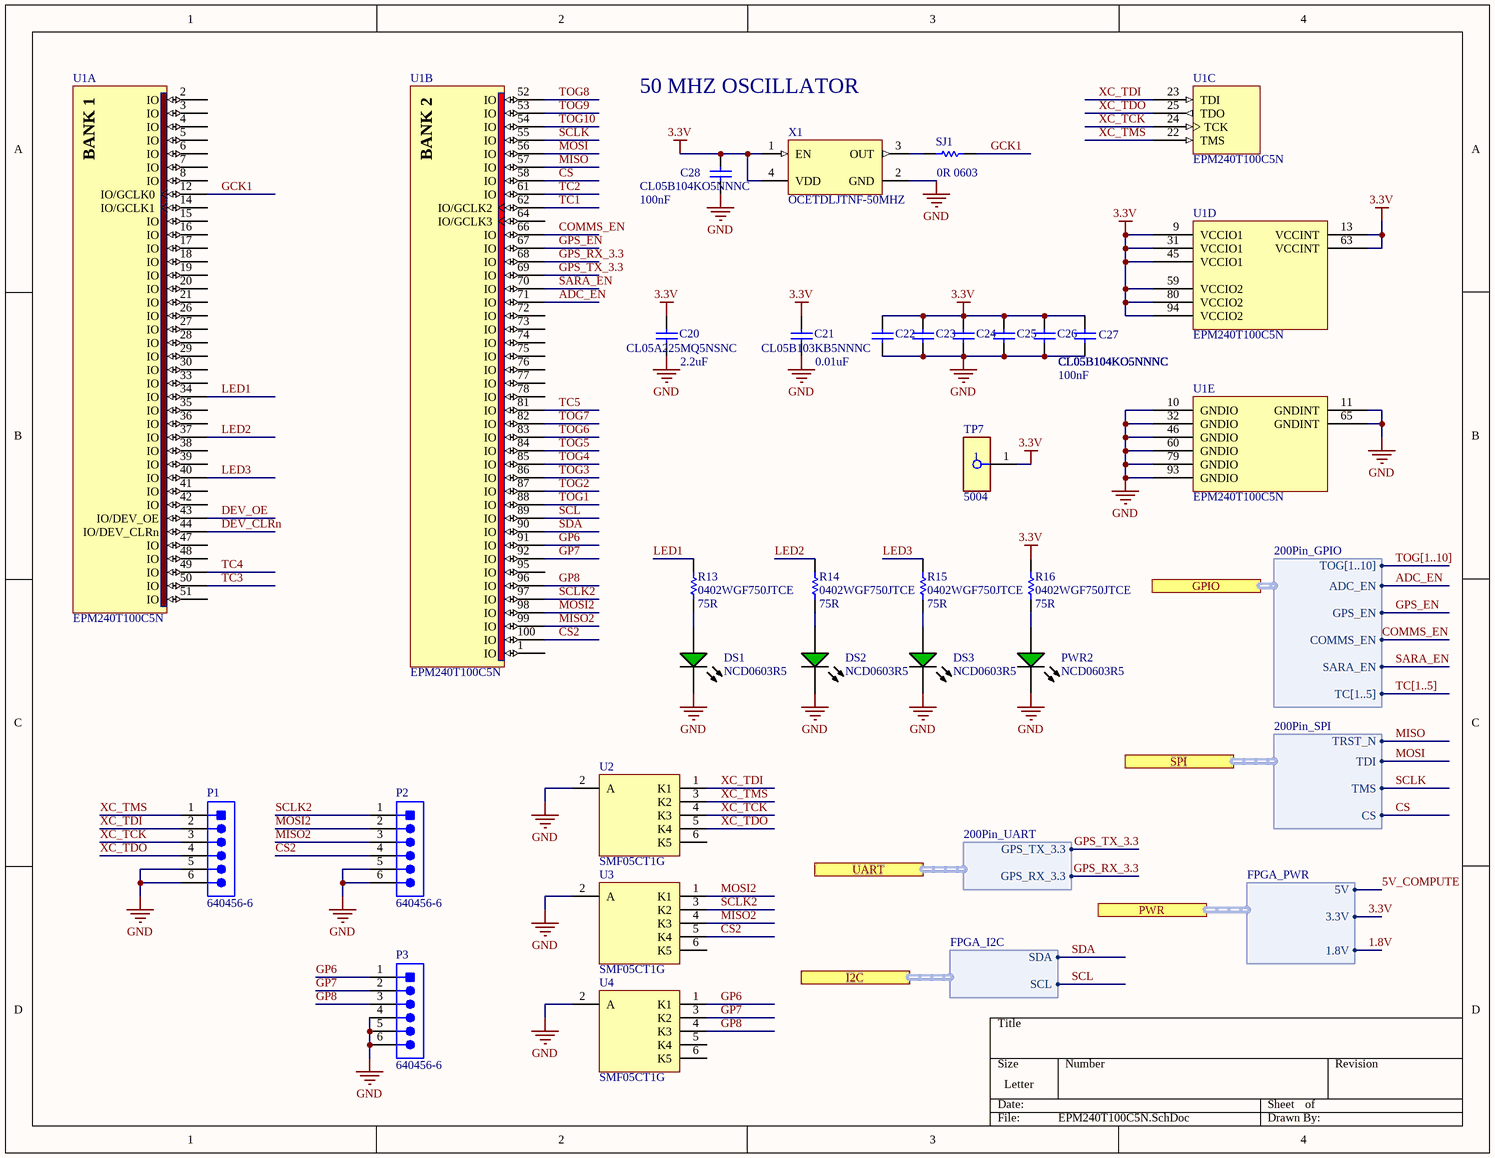
[diagram p7: EPM240T100C5N.SchDoc]

### Parts
(Parts that share a designator on the sheet are numbered #1, #2 ... from top to bottom, then left to right.)
C20#2  CL05A225MQ5NSNC  [CAPC0402(1005)60_M]
C21#2  CL05B103KB5NNNC  [CAPC1005X55X30NL05T10]
C22#2  CL05B104KO5NNNC  [CAPC1005X55X30ML05T10]
C23#2  CL05B104KO5NNNC  [CAPC1005X55X30ML05T10]
C24#2  CL05B104KO5NNNC  [CAPC1005X55X30ML05T10]
C25#2  CL05B104KO5NNNC  [CAPC1005X55X30ML05T10]
C26#2  CL05B104KO5NNNC  [CAPC1005X55X30ML05T10]
C27#2  CL05B104KO5NNNC  [CAPC1005X55X30ML05T10]
C28#2  CL05B104KO5NNNC  [CAPC1005X55X30ML05T10]
DS1#2  NCD0603R5  [AVAG-HSMX-C190_V]
DS2#2  NCD0603R5  [AVAG-HSMX-C190_V]
DS3#2  NCD0603R5  [AVAG-HSMX-C190_V]
P1#3  640456-6  [TECO-640456-6_V]
P2#2  640456-6  [TECO-640456-6_V]
P3#2  640456-6  [TECO-640456-6_V]
PWR2#2  NCD0603R5  [AVAG-HSMX-C190_V]
R13#2  0402WGF750JTCE  spec: 75R  [RESC1005X40X25ML05T10]
R14#2  0402WGF750JTCE  spec: 75R  [RESC1005X40X25ML05T10]
R15#2  0402WGF750JTCE  spec: 75R  [RESC1005X40X25ML05T10]
R16#2  0402WGF750JTCE  spec: 75R  [RESC1005X40X25ML05T10]
SJ1#2  0R 0603  [RESC1609X55X30ML10T20]
TP7#3  5004  [FP-5004-MFG]
U1#3  EPM240T100C5N  [TQFP100_L]  (parts A,B,C,D,E of 5)
U2#3  SMF05CT1G  [ONSC-SC70-6-419B-02_W_V]
U3#3  SMF05CT1G  [ONSC-SC70-6-419B-02_W_V]
U4#3  SMF05CT1G  [ONSC-SC70-6-419B-02_W_V]
X1#2  OCETDLJTNF-50MHZ  [TXC-L500W700H130-4_V]

### Ports
GPIO (harness 200Pin_GPIO), I2C (harness FPGA_I2C), PWR (harness FPGA_PWR), SPI (harness 200Pin_SPI), UART (harness 200Pin_UART)

### Harnesses
FPGA_I2C: SDA, SCL
200Pin_UART: GPS_TX_3.3, GPS_RX_3.3
FPGA_PWR: 5V, 3.3V, 1.8V
200Pin_SPI: TRST_N, TDI, TMS, CS
200Pin_GPIO: TOG[1..10], ADC_EN, GPS_EN, COMMS_EN, SARA_EN, TC[1..5]

### Nets
3.3V: C20#2.2 C21#2.2 C22#2.2 C23#2.2 C24#2.2 C25#2.2 C26#2.2 C27#2.2 C28#2.2 R16#2.2 TP7#3.1 U1#3.9(VCCIO1) U1#3.13(VCCINT) U1#3.31(VCCIO1) U1#3.45(VCCIO1) U1#3.59(VCCIO2) U1#3.63(VCCINT) U1#3.80(VCCIO2) U1#3.94(VCCIO2) X1#2.1(EN) X1#2.4(VDD) ; port PWR.3.3V
GND: C20#2.1 C21#2.1 C22#2.1 C23#2.1 C24#2.1 C25#2.1 C26#2.1 C27#2.1 C28#2.1 DS1#2.2(K) DS2#2.2(K) DS3#2.2(K) P1#3.5 P1#3.6 P2#2.5 P2#2.6 P3#2.4 P3#2.5 P3#2.6 PWR2#2.2(K) U1#3.10(GNDIO) U1#3.11(GNDINT) U1#3.32(GNDIO) U1#3.46(GNDIO) U1#3.60(GNDIO) U1#3.65(GNDINT) U1#3.79(GNDIO) U1#3.93(GNDIO) U2#3.2(A) U3#3.2(A) U4#3.2(A) X1#2.2(GND)
1.8V: port PWR.1.8V
5V_COMPUTE: port PWR.5V
ADC_EN: U1#3.71(IO) ; port GPIO.ADC_EN
COMMS_EN: U1#3.66(IO) ; port GPIO.COMMS_EN
CS: U1#3.58(IO) ; port SPI.CS
CS2: P2#2.4 U1#3.100(IO) U3#3.5(K4)
DEV_CLRn: U1#3.44(IO/DEV_CLRn)
DEV_OE: U1#3.43(IO/DEV_OE)
GCK1: SJ1#2.2 U1#3.12(IO/GCLK0)
GP6: P3#2.1 U1#3.91(IO) U4#3.1(K1)
GP7: P3#2.2 U1#3.92(IO) U4#3.3(K2)
GP8: P3#2.3 U1#3.96(IO) U4#3.4(K3)
GPS_EN: U1#3.67(IO) ; port GPIO.GPS_EN
GPS_RX_3.3: U1#3.68(IO) ; port UART.GPS_RX_3.3
GPS_TX_3.3: U1#3.69(IO) ; port UART.GPS_TX_3.3
LED1: R13#2.2 U1#3.34(IO)
LED2: R14#2.2 U1#3.37(IO)
LED3: R15#2.2 U1#3.40(IO)
MISO: U1#3.57(IO) ; port SPI.TRST_N
MISO2: P2#2.3 U1#3.99(IO) U3#3.4(K3)
MOSI: U1#3.56(IO) ; port SPI.TDI
MOSI2: P2#2.2 U1#3.98(IO) U3#3.1(K1)
SARA_EN: U1#3.70(IO) ; port GPIO.SARA_EN
SCL: U1#3.89(IO) ; port I2C.SCL
SCLK: U1#3.55(IO) ; port SPI.TMS
SCLK2: P2#2.1 U1#3.97(IO) U3#3.3(K2)
SDA: U1#3.90(IO) ; port I2C.SDA
TC1: U1#3.62(IO/GCLK2)
TC2: U1#3.61(IO)
TC3: U1#3.50(IO)
TC4: U1#3.49(IO)
TC5: U1#3.81(IO)
TOG1: U1#3.88(IO)
TOG2: U1#3.87(IO)
TOG3: U1#3.86(IO)
TOG4: U1#3.85(IO)
TOG5: U1#3.84(IO)
TOG6: U1#3.83(IO)
TOG7: U1#3.82(IO)
TOG8: U1#3.52(IO)
TOG9: U1#3.53(IO)
TOG10: U1#3.54(IO)
XC_TCK: P1#3.3 U1#3.24(TCK) U2#3.4(K3)
XC_TDI: P1#3.2 U1#3.23(TDI) U2#3.1(K1)
XC_TDO: P1#3.4 U1#3.25(TDO) U2#3.5(K4)
XC_TMS: P1#3.1 U1#3.22(TMS) U2#3.3(K2)
NetDS1#2_1: DS1#2.1(A) R13#2.1
NetDS2#2_1: DS2#2.1(A) R14#2.1
NetDS3#2_1: DS3#2.1(A) R15#2.1
NetPWR2#2_1: PWR2#2.1(A) R16#2.1
NetSJ1#2_1: SJ1#2.1 X1#2.3(OUT)

Not connected (* = marked no-connect by the designer): U1#3 1(IO) 2(IO) 3(IO) 4(IO) 5(IO) 6(IO) 7(IO) 8(IO) 14(IO/GCLK1) 15(IO) 16(IO) 17(IO) 18(IO) 19(IO) 20(IO) 21(IO) 26(IO) 27(IO) 28(IO) 29(IO) 30(IO) 33(IO) 35(IO) 36(IO) 38(IO) 39(IO) 41(IO) 42(IO) 47(IO) 48(IO) 51(IO) 64(IO/GCLK3) 72(IO) 73(IO) 74(IO) 75(IO) 76(IO) 77(IO) 78(IO) 95(IO); U2#3 6(K5); U3#3 6(K5); U4#3 5(K4) 6(K5)

### Buses and harness runs
bus TC[1..5]
bus TOG[1..10]

### Notes on the sheet
- 50 MHZ OSCILLATOR
- (near C28#2) 100nF
- (near C20#2) 2.2uF
- (near C21#2) 0.01uF
- 100nF
- (in symbol CMP-0144-00227-1, part A) BANK 1
- (in symbol CMP-0144-00227-1, part B) BANK 2

### Library data of the parts
C20#2 = CMP-1034-02125-1: 2.2uF 0402; Case-Metric: 1005; Rated Voltage: 6.3 V; Case-EIA: 0402; Tolerance: Â±10%; Value: 2.2uF; Technology: SMT; Max Thickness: 0.6 mm
C21#2 = CMP-2008-03072-1: 0.01uF 0402; Manufacturer: Kemet; Part Number: C0402C103K4RACTU
C22#2 C23#2 C24#2 C25#2 C26#2 C27#2 C28#2 = CMP-2008-03080-1: 100nF 0402; Manufacturer: Kemet; Part Number: C0402C104J4RACTU
DS1#2 DS2#2 DS3#2 PWR2#2 = CMP-1744-00002-1: as DS1#1 on sheet XC95144XL; Packaging: Tape and Reel; PackageReference: HSMX-C190; ComponentLink2URL: http://docs.avagotech.com/docs/AV02-0551EN; RoHSCompliant: true; Pins: 8; REACH SVHC: No SVHC; Max Operating Temperature: 85 degC; Width: 4 mm; Radiation Hardening: No; Package Quantity: 3000; ComponentLink3Description: Package Specification; ComponentLink1Description: Manufacturer URL; Min Operating Temperature: -40 degC; PackageDescription: 2-Pin Surface Mount Device, Body 1.6 x 0.8 mm, Height 0.9 mm; Max Clock Frequency: 100 KHz; Height: 1.5 mm; ComponentLink1URL: http://www.avagotech.com/; DatasheetVersion: Mar-12; ComponentLink2Description: Datasheet; Mount: Surface Mount; Length: 5 mm; ComponentLink3URL: http://www.fairchildsemi.com/dwg/MA/MA03D.pdf
P1#3 P2#2 P3#2 = CMP-2000-05661-1: as SPI on sheet 2_STM32F4; Termination: Solder; Package Reference: 640456-6; Size, Post: 0.025 / in.; Color: White; Datasheet URL: https://datasheet.ciiva.com/25618/0900766b80eb7fdd-25618163.pdf; Manufacturer URL: http://www.te.com/; Mounting Type: PCMount; Length, Pin: 0.14 / "; Type: PCBPlug; Length, Overall: 0.6 / "; Mounting Technology: ThroughHole; Number of Rows: 1; Contact Shape: Square; Contact Mating Area Plating: Tin; Datasheet Version: Rev. W, 05/2005; Number of Positions: 6; Package Description: Male Header, Pitch 2.54 mm, 1 x 6 Position, Height 10.03 mm, Tail Length 3.56 mm; Contact Plating: Tin; Length, Terminal Post: 0.14 / in.; Flammability Rating: UL94V-0
R13#2 R14#2 R15#2 R16#2 = CMP-2002-07344-1: as R201 on sheet 2_STM32F4
SJ1#2 = CMP-2000-03816-1: as SJ1#1 on sheet XC95144XL
TP7#3 = CMP-2000-05575-2: as TP3 on sheet 2_STM32F4; Device Class L1: Connectors; Manufacturer Part Number: 5004; Digikey Description: PC TEST POINT MINIATURE YELLOW; ComponentLink2URL: https://www.keyelco.com/product-pdf.cfm?p=1313; Lead Free: Yes; ComponentLink2Description: Datasheet; Category: Conn; Height: 4.72mm; Octopart: https://octopart.com/5004-keystone-28591; Mouser Description: TEST POINT PC MINI .040"D YELLOW; Device Class L3: unset; Contact Material: Silver; Package: 5004; Automotive: No; Device Class L2: unset; RoHS: TRUE
U1#3 = CMP-0144-00227-1: MAX II 3.3/2.5V CPLD, 80 IOs, 240 Logic Elements, 100-Pin Plastic TQFP, Commercial Temperature, Speed Grade 5, Pb-Free; Note1: Each set of VCCIO pins can be connected to 3.3V, 2.5V, 1.8V, or 1.5V.; Note2: All VCCINT pins must be connected to either 3.3V or 2.5V (but not a combination of both).; PackageDescription: 100-Pin Plastic Thin Quad Flat Pack (TQFP100) - Wire Bond; PackageReference: TQFP100; PackageVersion: ver15.1, May-2008; DatasheetVersion: ver1.8, Jul-2006; Code_JEDEC: MS-026-AED
U2#3 U3#3 U4#3 = CMP-1061-00155-1: as U2#2 on sheet XC95144XL; PackageDescription: 6-Pin Small Outline Transistor, Body 2 x 1.25 mm, Pitch 0.65 mm; PackageReference: SC70-6-419B-02_W; ComponentLink2Description: Datasheet; Mounting Technology: Surface Mount; Packing: Tape and Reel; DatasheetVersion: Rev. 4; ComponentLink1Description: Manufacturer URL; ComponentLink2URL: http://www.onsemi.com/pub_link/Collateral/SMF05C-D.PDF; ComponentLink3Description: Package Specification; ComponentLink1URL: http://www.onsemi.com/; ComponentLink3URL: http://www.onsemi.com/pub_link/Collateral/SMF05C-D.PDF; PackageVersion: Rev. W; PartNumber: SMF05CT1G; RoHS: Pb-Free
X1#2 = CMP-0269-00001-1: as X1#1 on sheet XC95144XL; ComponentLink2Description: Datasheet; Mounting Technology: Surface Mount; Storage Temperature: -50 to 125 degC; PackageReference: L500W700H130-4; ComponentLink1URL: http://www.txccrystal.com/; ComponentLink2URL: http://www.txccrystal.com/images/pdf/7w-tight.pdf; ComponentLink1Description: Manufacturer URL; PackageDescription: 4-Pin SMT LED, 7 x 5 mm Body; Operating Temperature Range: -40 to 85 degC

## Nets that join several sheets
1.8V: 200PinConnector (5 pins), 1_CMPower (C106.1 U103.1), 4_PeripheralsV2 (R403.1 T401.3), 3_JetsonDRAMConnector (5 pins)
3.3V: 200PinConnector (14 pins), 1_CMPower (C102.1 R101.2 TP2.1 U101.5), 4_PeripheralsV2 (R404.2), 3_JetsonDRAMConnector (U2#1.14 U3#1.14), 2_STM32F4 (32 pins), XC95144XL (20 pins), EPM240T100C5N (21 pins)
5V_COMPUTE: 200PinConnector (5 pins), 1_CMPower (7 pins), 4_PeripheralsV2 (C405.1 SJ401.2 U402.3), 3_JetsonDRAMConnector (16 pins)
CHGND: 200PinConnector (U7.2 U8.2 U9.2), 1_CMPower (D101.2), 4_PeripheralsV2 (21 pins), 3_JetsonDRAMConnector (7 pins), 2_STM32F4 (8 pins)
GND: 200PinConnector (71 pins), 1_CMPower (10 pins), 4_PeripheralsV2 (12 pins), 3_JetsonDRAMConnector (84 pins), 2_STM32F4 (50 pins), XC95144XL (33 pins), EPM240T100C5N (32 pins)
ADC_EN1V8: 3_JetsonDRAMConnector (M1#2.124), 2_STM32F4 (U1#1.46)
CBOX_RX_3.3: 3_JetsonDRAMConnector (U2#1.10), 2_STM32F4 (U1#1.34)
CBOX_TX_3.3: 3_JetsonDRAMConnector (U2#1.11), 2_STM32F4 (U1#1.35)
COMMS_EN1V8: 3_JetsonDRAMConnector (M1#2.127), 2_STM32F4 (U1#1.57)
CS: 3_JetsonDRAMConnector (M1#2.95), 2_STM32F4 (U1#1.40)
GPIO1: 3_JetsonDRAMConnector (M1#1.206), 2_STM32F4 (U1#1.28)
GPIO2: 3_JetsonDRAMConnector (M1#2.211), 2_STM32F4 (U1#1.26)
GPIO3: 3_JetsonDRAMConnector (M1#2.216), 2_STM32F4 (U1#1.27)
GPS_EN1V8: 3_JetsonDRAMConnector (M1#2.126), 2_STM32F4 (U1#1.47)
GPS_RX_3.3: 3_JetsonDRAMConnector (U2#1.12), 2_STM32F4 (U1#1.59)
GPS_TX_3.3: 3_JetsonDRAMConnector (U2#1.13), 2_STM32F4 (U1#1.58)
HDMI_CEC: 4_PeripheralsV2 (R404.1 T403.3), 3_JetsonDRAMConnector (M1#1.94)
HDMI_CLK_N: 4_PeripheralsV2 (HDMIPORT.12), 3_JetsonDRAMConnector (M1#1.81)
HDMI_CLK_P: 4_PeripheralsV2 (HDMIPORT.10), 3_JetsonDRAMConnector (M1#1.83)
HDMI_D0_N: 4_PeripheralsV2 (HDMIPORT.9), 3_JetsonDRAMConnector (M1#1.63)
HDMI_D0_P: 4_PeripheralsV2 (HDMIPORT.7), 3_JetsonDRAMConnector (M1#1.65)
HDMI_D1_N: 4_PeripheralsV2 (HDMIPORT.6), 3_JetsonDRAMConnector (M1#1.69)
HDMI_D1_P: 4_PeripheralsV2 (HDMIPORT.4), 3_JetsonDRAMConnector (M1#1.71)
HDMI_D2_N: 4_PeripheralsV2 (HDMIPORT.3), 3_JetsonDRAMConnector (M1#1.75)
HDMI_D2_P: 4_PeripheralsV2 (HDMIPORT.1), 3_JetsonDRAMConnector (M1#1.77)
HDMI_HPD_N_1V8: 4_PeripheralsV2 (R403.2 T402.3), 3_JetsonDRAMConnector (M1#1.96)
HDMI_SCL: 4_PeripheralsV2 (HDMIPORT.15 R402.1 U401.5), 3_JetsonDRAMConnector (M1#1.100)
HDMI_SDA: 4_PeripheralsV2 (HDMIPORT.16 R401.1 U401.4), 3_JetsonDRAMConnector (M1#1.98)
MISO: 3_JetsonDRAMConnector (M1#2.93), 2_STM32F4 (U1#1.42)
MOSI: 3_JetsonDRAMConnector (M1#2.89), 2_STM32F4 (U1#1.43)
OTG_USB_N: 4_PeripheralsV2 (D401.1 USBB1.2), 3_JetsonDRAMConnector (M1#2.109)
OTG_USB_P: 4_PeripheralsV2 (D402.1 USBB1.3), 3_JetsonDRAMConnector (M1#2.111)
OTG_VBUS: 4_PeripheralsV2 (T401.2), 3_JetsonDRAMConnector (M1#1.212)
SARA_CTS_3.3: 3_JetsonDRAMConnector (U3#1.10), 2_STM32F4 (U1#1.80)
SARA_EN1V8: 3_JetsonDRAMConnector (M1#2.128), 2_STM32F4 (U1#1.56)
SARA_RTS_3.3: 3_JetsonDRAMConnector (U3#1.11), 2_STM32F4 (U1#1.81)
SARA_RX_3.3: 3_JetsonDRAMConnector (U3#1.12), 2_STM32F4 (U1#1.111)
SARA_TX_3.3: 3_JetsonDRAMConnector (U3#1.13), 2_STM32F4 (U1#1.112)
SCL: 3_JetsonDRAMConnector (M1#2.185), 2_STM32F4 (U1#1.100)
SCLK: 3_JetsonDRAMConnector (M1#2.91), 2_STM32F4 (U1#1.41)
SDA: 3_JetsonDRAMConnector (M1#2.187), 2_STM32F4 (U1#1.99)
USB1_N: 4_PeripheralsV2 (D404.1 J4.6), 3_JetsonDRAMConnector (M1#2.115)
USB1_P: 4_PeripheralsV2 (D405.1 J4.7), 3_JetsonDRAMConnector (M1#2.117)
USB2_N: 4_PeripheralsV2 (D403.1 J4.2), 3_JetsonDRAMConnector (M1#2.121)
USB2_P: 4_PeripheralsV2 (D406.1 J4.3), 3_JetsonDRAMConnector (M1#2.123)